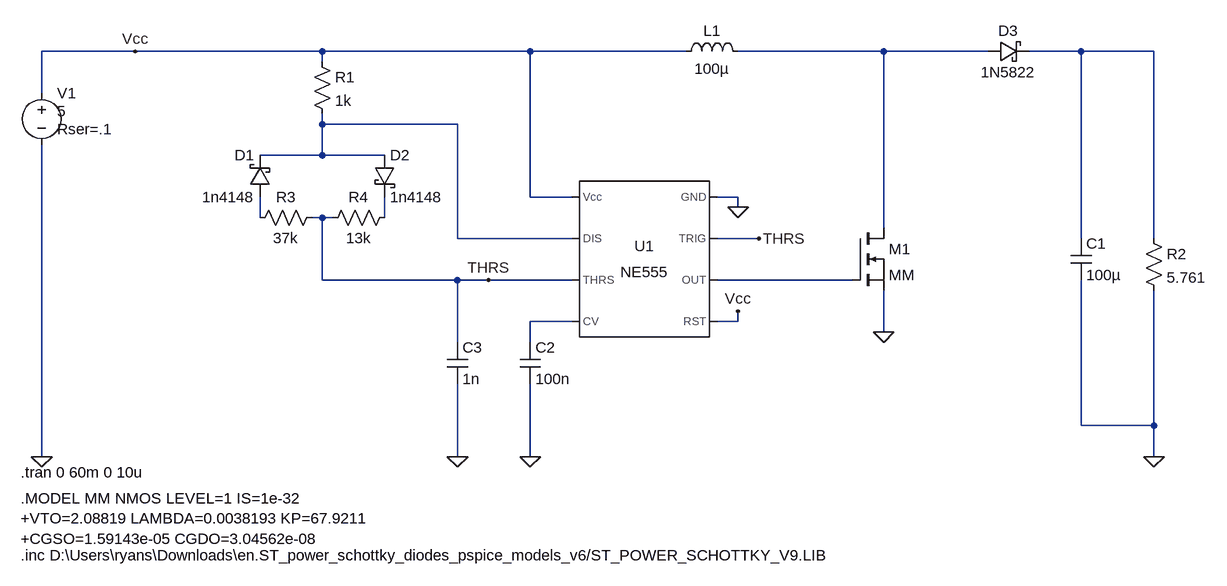
[diagram p0: schematic Improved Converter.asc]
Improved Converter.asc, the LTspice schematic file:
Version 4
SHEET 1 1432 680
WIRE -384 -160 -528 -160
WIRE -96 -160 -384 -160
WIRE 224 -160 -96 -160
WIRE 464 -160 224 -160
WIRE 768 -160 544 -160
WIRE 928 -160 768 -160
WIRE 1072 -160 992 -160
WIRE 1184 -160 1072 -160
WIRE -96 -144 -96 -160
WIRE -528 -96 -528 -160
WIRE -96 -48 -96 -64
WIRE 112 -48 -96 -48
WIRE -96 0 -96 -48
WIRE -96 0 -192 0
WIRE 0 0 -96 0
WIRE 224 64 224 -160
WIRE 288 64 224 64
WIRE 544 64 512 64
WIRE 544 80 544 64
WIRE -192 96 -192 64
WIRE -96 96 -112 96
WIRE -80 96 -96 96
WIRE 0 96 0 64
WIRE 768 112 768 -160
WIRE 112 128 112 -48
WIRE 288 128 112 128
WIRE 576 128 512 128
WIRE 1072 128 1072 -160
WIRE 1184 128 1184 -160
WIRE -96 192 -96 96
WIRE 112 192 -96 192
WIRE 160 192 112 192
WIRE 288 192 160 192
WIRE 720 192 512 192
WIRE 288 256 224 256
WIRE 544 256 544 240
WIRE 544 256 512 256
WIRE 768 272 768 208
WIRE 112 288 112 192
WIRE 224 288 224 256
WIRE 1072 416 1072 192
WIRE 1184 416 1184 208
WIRE 1184 416 1072 416
WIRE -528 464 -528 -16
WIRE 112 464 112 352
WIRE 224 464 224 352
WIRE 1184 464 1184 416
FLAG -528 464 0
FLAG 1184 464 0
FLAG 768 272 0
FLAG 224 464 0
FLAG 112 464 0
FLAG 544 80 0
FLAG -384 -160 Vcc
FLAG 544 240 Vcc
FLAG 160 192 THRS
FLAG 576 128 THRS
SYMBOL Misc\\NE555 400 160 M0
SYMATTR InstName U1
SYMBOL voltage -528 -112 R0
WINDOW 3 24 44 Left 2
WINDOW 123 0 0 Left 0
WINDOW 39 24 72 Left 2
SYMATTR Value 5
SYMATTR SpiceLine Rser=.1
SYMATTR InstName V1
SYMBOL res -112 -160 R0
SYMATTR InstName R1
SYMATTR Value 1k
SYMBOL schottky -176 64 R180
WINDOW 0 24 64 Left 2
WINDOW 3 24 0 Left 2
SYMATTR InstName D1
SYMATTR Value 1n4148
SYMATTR Description Diode
SYMATTR Type diode
SYMBOL ind 448 -144 R270
WINDOW 0 32 56 VTop 2
WINDOW 3 5 56 VBottom 2
SYMATTR InstName L1
SYMATTR Value 100µ
SYMBOL nmos 720 112 R0
SYMATTR InstName M1
SYMATTR Value MM
SYMBOL cap 1056 128 R0
SYMATTR InstName C1
SYMATTR Value 100µ
SYMBOL res 1168 112 R0
SYMATTR InstName R2
SYMATTR Value 5.761
SYMBOL cap 208 288 R0
SYMATTR InstName C2
SYMATTR Value 100n
SYMBOL cap 96 288 R0
SYMATTR InstName C3
SYMATTR Value 1n
SYMBOL res -96 80 R90
WINDOW 0 0 56 VBottom 2
WINDOW 3 32 56 VTop 2
SYMATTR InstName R3
SYMATTR Value 37k
SYMBOL res 16 80 R90
WINDOW 0 0 56 VBottom 2
WINDOW 3 32 56 VTop 2
SYMATTR InstName R4
SYMATTR Value 13k
SYMBOL schottky -16 0 R0
SYMATTR InstName D2
SYMATTR Value 1n4148
SYMATTR Description Diode
SYMATTR Type diode
SYMBOL schottky 928 -144 R270
WINDOW 0 32 32 VTop 2
WINDOW 3 0 32 VBottom 2
SYMATTR InstName D3
SYMATTR Value 1N5822
SYMATTR Description Diode
SYMATTR Type diode
TEXT -560 488 Left 2 !.tran 0 60m 0 10u
TEXT -560 528 Left 2 !.MODEL MM NMOS LEVEL=1 IS=1e-32\n+VTO=2.08819 LAMBDA=0.0038193 KP=67.9211\n+CGSO=1.59143e-05 CGDO=3.04562e-08
TEXT -560 616 Left 2 !.inc D:\\Users\\ryans\\Downloads\\en.ST_power_schottky_diodes_pspice_models_v6/ST_POWER_SCHOTTKY_V9.LIB

The netlist it stands for:
* Improved Converter.asc
XU1 0 THRS N006 Vcc N007 THRS N003 Vcc NE555  ; pins GND TRIG OUT RST CV THRS DIS Vcc
V1 Vcc 0 5 Rser=.1
R1 Vcc N003 1k
D1 N004 N003 1n4148
L1 Vcc N001 100µ
M1 N001 N006 0 0 MM
C1 N002 0 100µ
R2 N002 0 5.761
C2 N007 0 100n
C3 THRS 0 1n
R3 THRS N004 37k
R4 N005 THRS 13k
D2 N003 N005 1n4148
D3 N001 N002 1N5822
.model D D
.lib standard.dio
.model NMOS NMOS
.model PMOS PMOS
.lib standard.mos
.tran 0 60m 0 10u
.MODEL MM NMOS LEVEL=1 IS=1e-32
+VTO=2.08819 LAMBDA=0.0038193 KP=67.9211
+CGSO=1.59143e-05 CGDO=3.04562e-08
.inc D:\Users\ryans\Downloads\en.ST_power_schottky_diodes_pspice_models_v6/ST_POWER_SCHOTTKY_V9.LIB
.lib NE555.sub
.backanno
.end